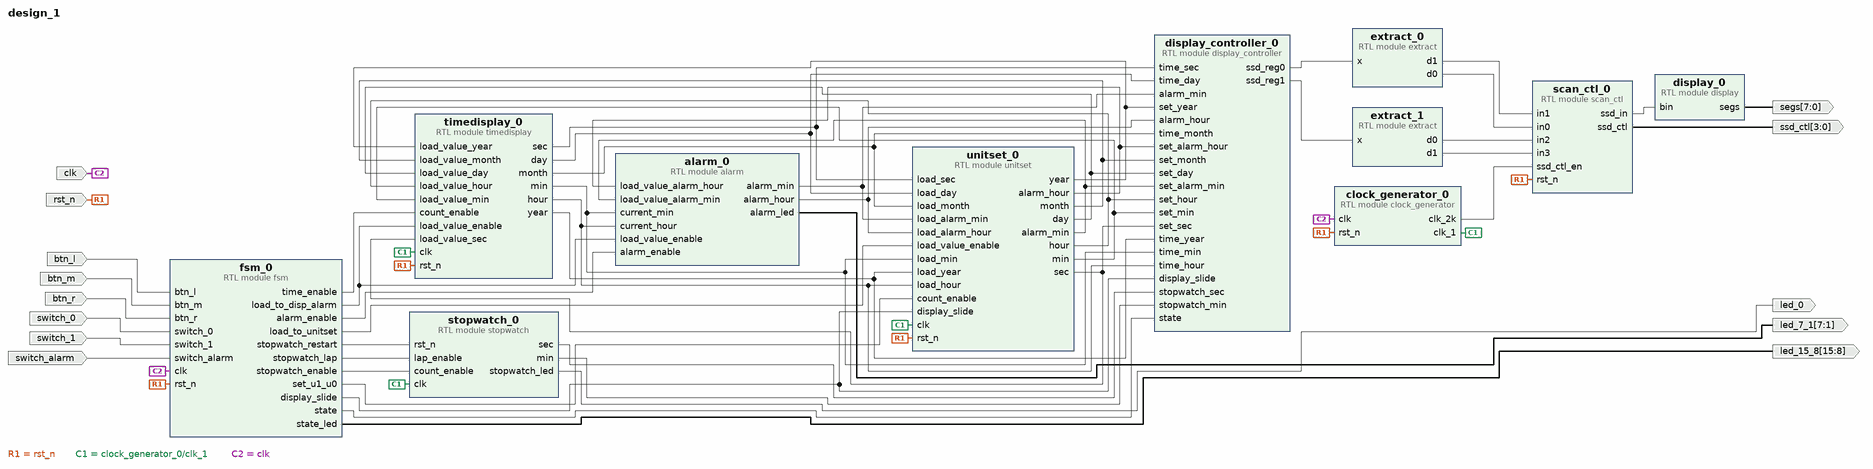
[diagram p0: block diagram of the top level]
# Vivado block design design_1, xc7a35tcpg236-1, Vivado 2019.2
create_bd_design design_1

create_bd_port -dir I -type rst rst_n
set_property -dict {CONFIG.POLARITY ACTIVE_HIGH} [get_bd_ports rst_n]
create_bd_port -dir I clk
create_bd_port -dir I btn_l
create_bd_port -dir I btn_m
create_bd_port -dir I btn_r
create_bd_port -dir I switch_0
create_bd_port -dir I switch_1
create_bd_port -dir I switch_alarm
create_bd_port -dir O -from 7 -to 0 segs
create_bd_port -dir O -from 3 -to 0 ssd_ctl
create_bd_port -dir O led_0
create_bd_port -dir O -from 7 -to 1 led_7_1
create_bd_port -dir O -from 15 -to 8 led_15_8

create_bd_cell -type module -reference fsm fsm_0
create_bd_cell -type module -reference unitset unitset_0
create_bd_cell -type module -reference stopwatch stopwatch_0
create_bd_cell -type module -reference timedisplay timedisplay_0
create_bd_cell -type module -reference alarm alarm_0
create_bd_cell -type module -reference display_controller display_controller_0
create_bd_cell -type module -reference scan_ctl scan_ctl_0
create_bd_cell -type module -reference clock_generator clock_generator_0
create_bd_cell -type module -reference extract extract_0
create_bd_cell -type module -reference extract extract_1
create_bd_cell -type module -reference display display_0

# ---- connections ----

connect_bd_net [get_bd_pins unitset_0/alarm_hour] [get_bd_pins alarm_0/load_value_alarm_hour] [get_bd_pins display_controller_0/set_alarm_hour]
connect_bd_net [get_bd_pins unitset_0/alarm_min] [get_bd_pins alarm_0/load_value_alarm_min] [get_bd_pins display_controller_0/set_alarm_min]
connect_bd_net [get_bd_pins unitset_0/year] [get_bd_pins timedisplay_0/load_value_year] [get_bd_pins display_controller_0/set_year]
connect_bd_net [get_bd_pins unitset_0/month] [get_bd_pins timedisplay_0/load_value_month] [get_bd_pins display_controller_0/set_month]
connect_bd_net [get_bd_pins unitset_0/day] [get_bd_pins timedisplay_0/load_value_day] [get_bd_pins display_controller_0/set_day]
connect_bd_net [get_bd_pins unitset_0/hour] [get_bd_pins timedisplay_0/load_value_hour] [get_bd_pins display_controller_0/set_hour]
connect_bd_net [get_bd_pins unitset_0/min] [get_bd_pins timedisplay_0/load_value_min] [get_bd_pins display_controller_0/set_min]
connect_bd_net [get_bd_pins unitset_0/sec] [get_bd_pins timedisplay_0/load_value_sec] [get_bd_pins display_controller_0/set_sec]
connect_bd_net [get_bd_pins alarm_0/alarm_min] [get_bd_pins unitset_0/load_alarm_min] [get_bd_pins display_controller_0/alarm_min]
connect_bd_net [get_bd_pins alarm_0/alarm_hour] [get_bd_pins unitset_0/load_alarm_hour] [get_bd_pins display_controller_0/alarm_hour]
connect_bd_net [get_bd_pins timedisplay_0/sec] [get_bd_pins unitset_0/load_sec] [get_bd_pins display_controller_0/time_sec]
connect_bd_net [get_bd_pins timedisplay_0/day] [get_bd_pins unitset_0/load_day] [get_bd_pins display_controller_0/time_day]
connect_bd_net [get_bd_pins timedisplay_0/month] [get_bd_pins unitset_0/load_month] [get_bd_pins display_controller_0/time_month]
connect_bd_net [get_bd_pins timedisplay_0/year] [get_bd_pins unitset_0/load_year] [get_bd_pins display_controller_0/time_year]
connect_bd_net [get_bd_pins fsm_0/stopwatch_restart] [get_bd_pins stopwatch_0/rst_n]
connect_bd_net [get_bd_pins fsm_0/stopwatch_lap] [get_bd_pins stopwatch_0/lap_enable]
connect_bd_net [get_bd_pins fsm_0/alarm_enable] [get_bd_pins alarm_0/alarm_enable]
connect_bd_net [get_bd_pins fsm_0/time_enable] [get_bd_pins timedisplay_0/count_enable]
connect_bd_net [get_bd_pins fsm_0/stopwatch_enable] [get_bd_pins stopwatch_0/count_enable]
connect_bd_net [get_bd_pins fsm_0/load_to_disp_alarm] [get_bd_pins alarm_0/load_value_enable] [get_bd_pins timedisplay_0/load_value_enable]
connect_bd_net [get_bd_pins fsm_0/load_to_unitset] [get_bd_pins unitset_0/load_value_enable]
connect_bd_net [get_bd_pins fsm_0/display_slide] [get_bd_pins unitset_0/display_slide] [get_bd_pins display_controller_0/display_slide]
connect_bd_net [get_bd_pins stopwatch_0/sec] [get_bd_pins display_controller_0/stopwatch_sec]
connect_bd_net [get_bd_pins stopwatch_0/min] [get_bd_pins display_controller_0/stopwatch_min]
connect_bd_net [get_bd_pins fsm_0/state] [get_bd_pins display_controller_0/state]
connect_bd_net [get_bd_pins timedisplay_0/min] \
  [get_bd_pins alarm_0/current_min] [get_bd_pins unitset_0/load_min] [get_bd_pins display_controller_0/time_min]
connect_bd_net [get_bd_pins timedisplay_0/hour] \
  [get_bd_pins display_controller_0/time_hour] [get_bd_pins alarm_0/current_hour] [get_bd_pins unitset_0/load_hour]
connect_bd_net [get_bd_ports rst_n] \
  [get_bd_pins fsm_0/rst_n] [get_bd_pins timedisplay_0/rst_n] [get_bd_pins unitset_0/rst_n] \
  [get_bd_pins clock_generator_0/rst_n] [get_bd_pins scan_ctl_0/rst_n]
connect_bd_net [get_bd_pins clock_generator_0/clk_1] [get_bd_pins unitset_0/clk] [get_bd_pins stopwatch_0/clk] [get_bd_pins timedisplay_0/clk]
connect_bd_net [get_bd_pins clock_generator_0/clk_2k] [get_bd_pins scan_ctl_0/ssd_ctl_en]
connect_bd_net [get_bd_ports clk] [get_bd_pins clock_generator_0/clk] [get_bd_pins fsm_0/clk]
connect_bd_net [get_bd_ports btn_l] [get_bd_pins fsm_0/btn_l]
connect_bd_net [get_bd_ports btn_m] [get_bd_pins fsm_0/btn_m]
connect_bd_net [get_bd_ports btn_r] [get_bd_pins fsm_0/btn_r]
connect_bd_net -net switch_0_1 [get_bd_ports switch_0] [get_bd_pins fsm_0/switch_0]
connect_bd_net -net switch_1_1 [get_bd_ports switch_1] [get_bd_pins fsm_0/switch_1]
connect_bd_net [get_bd_ports switch_alarm] [get_bd_pins fsm_0/switch_alarm]
connect_bd_net [get_bd_pins display_controller_0/ssd_reg0] [get_bd_pins extract_0/x]
connect_bd_net [get_bd_pins extract_0/d1] [get_bd_pins scan_ctl_0/in1]
connect_bd_net [get_bd_pins extract_0/d0] [get_bd_pins scan_ctl_0/in0]
connect_bd_net [get_bd_pins display_controller_0/ssd_reg1] [get_bd_pins extract_1/x]
connect_bd_net [get_bd_pins extract_1/d0] [get_bd_pins scan_ctl_0/in2]
connect_bd_net [get_bd_pins extract_1/d1] [get_bd_pins scan_ctl_0/in3]
connect_bd_net [get_bd_pins scan_ctl_0/ssd_in] [get_bd_pins display_0/bin]
connect_bd_net [get_bd_pins display_0/segs] [get_bd_ports segs]
connect_bd_net [get_bd_pins scan_ctl_0/ssd_ctl] [get_bd_ports ssd_ctl]
connect_bd_net [get_bd_pins fsm_0/set_u1_u0] [get_bd_pins unitset_0/count_enable]
connect_bd_net [get_bd_pins stopwatch_0/stopwatch_led] [get_bd_ports led_0]
connect_bd_net [get_bd_pins alarm_0/alarm_led] [get_bd_ports led_7_1]
connect_bd_net [get_bd_pins fsm_0/state_led] [get_bd_ports led_15_8]

validate_bd_design
save_bd_design
